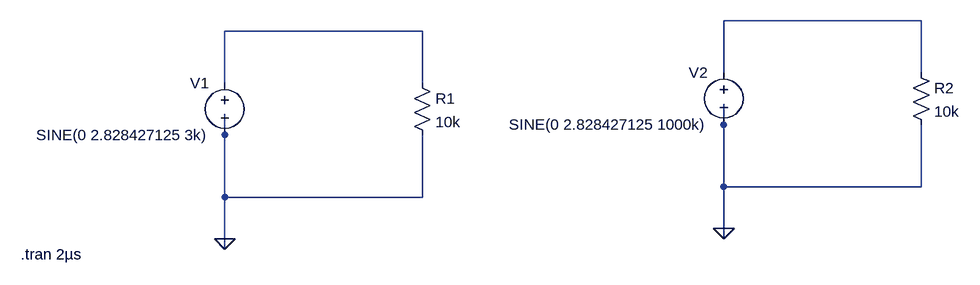
[diagram p0: schematic 2_3SineNoOffsetT1andT2.asc]
2_3SineNoOffsetT1andT2.asc, the LTspice schematic file:
Version 4
SHEET 1 1236 680
WIRE 1168 32 864 32
WIRE 400 48 96 48
WIRE 864 112 864 32
WIRE 1168 112 1168 32
WIRE 96 128 96 48
WIRE 400 128 400 48
WIRE 864 192 864 160
WIRE 96 208 96 176
WIRE 864 288 864 192
WIRE 1168 288 1168 192
WIRE 1168 288 864 288
WIRE 96 304 96 208
WIRE 400 304 400 208
WIRE 400 304 96 304
WIRE 864 352 864 288
WIRE 96 368 96 304
WIRE 864 368 864 352
WIRE 96 384 96 368
FLAG 96 368 0
FLAG 864 352 0
SYMBOL voltage 96 112 M0
WINDOW 123 0 0 Left 0
WINDOW 39 0 0 Left 0
SYMATTR InstName V1
SYMATTR Value SINE(0 2.828427125 3k)
SYMBOL res 384 112 R0
SYMATTR InstName R1
SYMATTR Value 10k
SYMBOL voltage 864 96 M0
WINDOW 123 0 0 Left 0
WINDOW 39 0 0 Left 0
SYMATTR InstName V2
SYMATTR Value SINE(0 2.828427125 1000k)
SYMBOL res 1152 96 R0
SYMATTR InstName R2
SYMATTR Value 10k
TEXT -218 392 Left 2 !.tran 2µs

The netlist it stands for:
* 2_3SineNoOffsetT1andT2.asc
V1 N002 0 SINE(0 2.828427125 3k)
R1 N002 0 10k
V2 N001 0 SINE(0 2.828427125 1000k)
R2 N001 0 10k
.tran 2µs
.backanno
.end